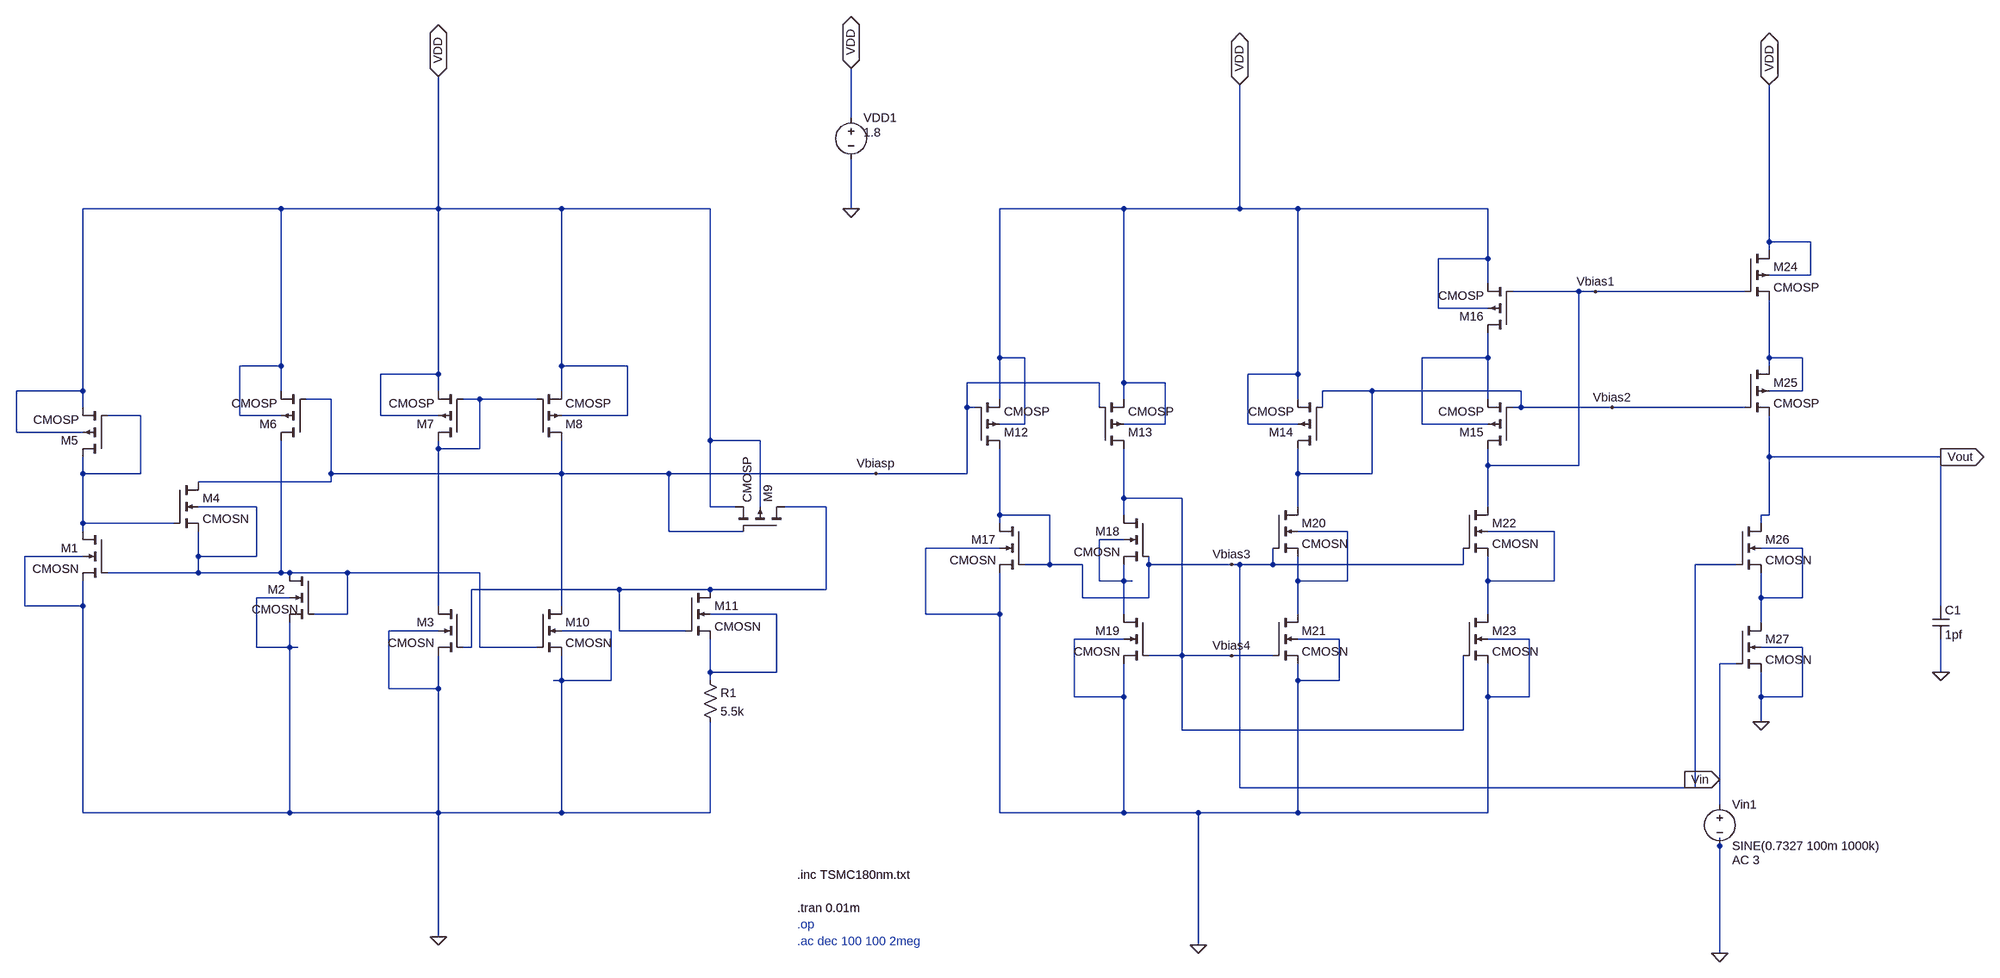
[diagram p0: schematic 180nm.asc]
180nm.asc, the LTspice schematic file:
Version 4
SHEET 1 4800 1076
WIRE 2240 -624 2240 -720
WIRE 1088 -448 704 -448
WIRE 1392 -448 1392 -704
WIRE 1392 -448 1088 -448
WIRE 1680 -448 1392 -448
WIRE 1968 -448 1680 -448
WIRE 2240 -448 2240 -544
WIRE 2768 -448 2528 -448
WIRE 2992 -448 2992 -688
WIRE 2992 -448 2768 -448
WIRE 3104 -448 2992 -448
WIRE 3472 -448 3104 -448
WIRE 4128 -384 4128 -688
WIRE 4208 -384 4128 -384
WIRE 4128 -368 4128 -384
WIRE 3472 -352 3472 -448
WIRE 3472 -352 3376 -352
WIRE 4208 -320 4208 -384
WIRE 4208 -320 4128 -320
WIRE 3472 -304 3472 -352
WIRE 3648 -288 3520 -288
WIRE 3680 -288 3648 -288
WIRE 4080 -288 3680 -288
WIRE 3376 -256 3376 -352
WIRE 3472 -256 3376 -256
WIRE 2528 -160 2528 -448
WIRE 2576 -160 2528 -160
WIRE 3472 -160 3472 -208
WIRE 3472 -160 3344 -160
WIRE 4128 -160 4128 -272
WIRE 4192 -160 4128 -160
WIRE 1088 -144 1088 -448
WIRE 1088 -144 1008 -144
WIRE 1680 -144 1680 -448
WIRE 1808 -144 1680 -144
WIRE 4128 -144 4128 -160
WIRE 1392 -128 1392 -448
WIRE 1392 -128 1280 -128
WIRE 3104 -128 3104 -448
WIRE 3104 -128 3008 -128
WIRE 2720 -112 2464 -112
WIRE 2768 -112 2768 -448
WIRE 2848 -112 2768 -112
WIRE 704 -96 704 -448
WIRE 704 -96 576 -96
WIRE 1088 -96 1088 -144
WIRE 1392 -96 1392 -128
WIRE 1680 -96 1680 -144
WIRE 3248 -96 3152 -96
WIRE 3536 -96 3248 -96
WIRE 4192 -96 4192 -160
WIRE 4192 -96 4128 -96
WIRE 1184 -80 1136 -80
WIRE 1472 -80 1440 -80
WIRE 1632 -80 1472 -80
WIRE 2528 -80 2528 -160
WIRE 2768 -80 2768 -112
WIRE 3104 -80 3104 -128
WIRE 3472 -80 3472 -160
WIRE 704 -64 704 -96
WIRE 2464 -64 2464 -112
WIRE 2480 -64 2464 -64
WIRE 2720 -64 2720 -112
WIRE 3152 -64 3152 -96
WIRE 3536 -64 3536 -96
WIRE 3536 -64 3520 -64
WIRE 3712 -64 3536 -64
WIRE 4080 -64 3712 -64
WIRE 816 -48 752 -48
WIRE 1008 -48 1008 -144
WIRE 1088 -48 1008 -48
WIRE 1280 -48 1280 -128
WIRE 1392 -48 1280 -48
WIRE 1808 -48 1808 -144
WIRE 1808 -48 1680 -48
WIRE 2576 -32 2576 -160
WIRE 2576 -32 2528 -32
WIRE 2848 -32 2848 -112
WIRE 2848 -32 2768 -32
WIRE 3008 -32 3008 -128
WIRE 3104 -32 3008 -32
WIRE 3344 -32 3344 -160
WIRE 3472 -32 3344 -32
WIRE 576 -16 576 -96
WIRE 704 -16 576 -16
WIRE 1968 0 1968 -448
WIRE 2064 0 1968 0
WIRE 1392 16 1392 0
WIRE 1472 16 1472 -80
WIRE 1472 16 1392 16
WIRE 4128 32 4128 -48
WIRE 4688 32 4128 32
WIRE 3472 48 3472 16
WIRE 3648 48 3648 -288
WIRE 3648 48 3472 48
WIRE 704 64 704 32
WIRE 816 64 816 -48
WIRE 816 64 704 64
WIRE 1184 64 1184 -80
WIRE 1680 64 1680 0
WIRE 1680 64 1184 64
WIRE 1888 64 1680 64
WIRE 2288 64 1888 64
WIRE 2464 64 2464 -64
WIRE 2464 64 2288 64
WIRE 3104 64 3104 16
WIRE 3248 64 3248 -96
WIRE 3248 64 3104 64
WIRE 1184 80 1184 64
WIRE 1184 80 928 80
WIRE 2768 112 2768 16
WIRE 2880 112 2768 112
WIRE 1040 128 928 128
WIRE 1968 128 1968 0
WIRE 2016 128 1968 128
WIRE 2064 128 2064 0
WIRE 2192 128 2112 128
WIRE 3104 128 3104 64
WIRE 3472 128 3472 48
WIRE 2528 144 2528 16
WIRE 2624 144 2528 144
WIRE 2768 144 2768 112
WIRE 4128 144 4128 32
WIRE 4128 144 4112 144
WIRE 704 160 704 64
WIRE 880 160 704 160
WIRE 2528 160 2528 144
WIRE 4112 160 4112 144
WIRE 704 176 704 160
WIRE 1888 176 1888 64
WIRE 2032 176 1888 176
WIRE 3200 176 3104 176
WIRE 3600 176 3472 176
WIRE 2768 192 2720 192
WIRE 2528 208 2384 208
WIRE 4192 208 4112 208
WIRE 704 224 592 224
WIRE 928 224 928 176
WIRE 1040 224 1040 128
WIRE 1040 224 928 224
WIRE 2624 240 2624 144
WIRE 2624 240 2576 240
WIRE 2688 240 2624 240
WIRE 2816 240 2816 224
WIRE 2976 240 2816 240
WIRE 2992 240 2976 240
WIRE 3056 240 3056 208
WIRE 3056 240 2992 240
WIRE 3424 240 3424 208
WIRE 3424 240 3056 240
WIRE 4064 240 3984 240
WIRE 928 256 928 224
WIRE 928 256 752 256
WIRE 1088 256 1088 0
WIRE 1088 256 928 256
WIRE 1104 256 1088 256
WIRE 1216 256 1104 256
WIRE 1472 256 1216 256
WIRE 2720 272 2720 192
WIRE 2768 272 2768 240
WIRE 2768 272 2720 272
WIRE 2784 272 2768 272
WIRE 3104 272 3104 224
WIRE 3200 272 3200 176
WIRE 3200 272 3104 272
WIRE 3472 272 3472 224
WIRE 3600 272 3600 176
WIRE 3600 272 3472 272
WIRE 1792 288 1456 288
WIRE 1968 288 1792 288
WIRE 2192 288 2192 128
WIRE 2192 288 1968 288
WIRE 1104 304 1040 304
WIRE 1968 304 1968 288
WIRE 2688 304 2688 240
WIRE 2816 304 2816 240
WIRE 2816 304 2688 304
WIRE 4112 304 4112 256
WIRE 4192 304 4192 208
WIRE 4192 304 4112 304
WIRE 592 320 592 224
WIRE 704 320 704 272
WIRE 704 320 592 320
WIRE 1392 320 1392 16
WIRE 1680 320 1680 64
WIRE 4688 320 4688 32
WIRE 1216 336 1216 256
WIRE 1216 336 1152 336
WIRE 2096 336 1968 336
WIRE 2384 336 2384 208
WIRE 2528 336 2528 256
WIRE 2528 336 2384 336
WIRE 2768 336 2768 272
WIRE 3104 336 3104 272
WIRE 3472 336 3472 272
WIRE 4112 352 4112 304
WIRE 1392 368 1296 368
WIRE 1776 368 1680 368
WIRE 1792 368 1792 288
WIRE 1920 368 1792 368
WIRE 2768 384 2672 384
WIRE 3184 384 3104 384
WIRE 3552 384 3472 384
WIRE 1040 400 1040 304
WIRE 1104 400 1104 352
WIRE 1104 400 1040 400
WIRE 1120 400 1104 400
WIRE 1456 400 1456 288
WIRE 1456 400 1440 400
WIRE 1472 400 1472 256
WIRE 1632 400 1472 400
WIRE 4192 400 4112 400
WIRE 2880 416 2880 112
WIRE 2880 416 2816 416
WIRE 2976 416 2880 416
WIRE 3056 416 2976 416
WIRE 4064 432 4032 432
WIRE 1968 448 1968 384
WIRE 2096 448 2096 336
WIRE 2096 448 1968 448
WIRE 4688 448 4688 384
WIRE 1680 464 1680 416
WIRE 1680 464 1664 464
WIRE 1776 464 1776 368
WIRE 1776 464 1680 464
WIRE 1968 464 1968 448
WIRE 3104 464 3104 432
WIRE 3184 464 3184 384
WIRE 3184 464 3104 464
WIRE 1296 480 1296 368
WIRE 1392 480 1392 416
WIRE 1392 480 1296 480
WIRE 2672 496 2672 384
WIRE 2768 496 2768 432
WIRE 2768 496 2672 496
WIRE 3472 496 3472 432
WIRE 3552 496 3552 384
WIRE 3552 496 3472 496
WIRE 4112 496 4112 448
WIRE 4192 496 4192 400
WIRE 4192 496 4112 496
WIRE 4112 544 4112 496
WIRE 2880 560 2880 416
WIRE 3424 560 3424 416
WIRE 3424 560 2880 560
WIRE 4032 656 4032 432
WIRE 2992 672 2992 240
WIRE 3984 672 3984 240
WIRE 3984 672 2992 672
WIRE 4032 704 4032 656
WIRE 704 720 704 320
WIRE 1104 720 1104 400
WIRE 1104 720 704 720
WIRE 1392 720 1392 480
WIRE 1392 720 1104 720
WIRE 1680 720 1680 464
WIRE 1680 720 1392 720
WIRE 1968 720 1968 544
WIRE 1968 720 1680 720
WIRE 2528 720 2528 336
WIRE 2768 720 2768 496
WIRE 2768 720 2528 720
WIRE 2912 720 2768 720
WIRE 3104 720 3104 464
WIRE 3104 720 2912 720
WIRE 3472 720 3472 496
WIRE 3472 720 3104 720
WIRE 4032 784 4032 768
WIRE 1392 960 1392 720
WIRE 2912 976 2912 720
WIRE 4032 992 4032 784
FLAG 4128 -688 VDD
IOPIN 4128 -688 BiDir
FLAG 4112 544 0
FLAG 4688 448 0
FLAG 4688 32 Vout
IOPIN 4688 32 Out
FLAG 2240 -448 0
FLAG 2240 -720 VDD
IOPIN 2240 -720 BiDir
FLAG 4032 656 Vin
IOPIN 4032 656 In
FLAG 2288 64 Vbiasp
FLAG 3680 -288 Vbias1
FLAG 3712 -64 Vbias2
FLAG 2976 240 Vbias3
FLAG 2976 416 Vbias4
FLAG 4032 992 0
FLAG 1392 -704 VDD
IOPIN 1392 -704 BiDir
FLAG 1392 960 0
FLAG 2992 -688 VDD
IOPIN 2992 -688 BiDir
FLAG 2912 976 0
SYMBOL nmos4 752 176 M0
SYMATTR InstName M1
SYMATTR Value CMOSN
SYMATTR Value2 l=360n w=1800n
SYMBOL nmos4 1152 256 M0
WINDOW 3 121 71 Right 2
SYMATTR Value CMOSN
SYMATTR InstName M2
SYMATTR Value2 l=360n w=1800n
SYMBOL nmos4 1440 320 M0
SYMATTR InstName M3
SYMATTR Value CMOSN
SYMATTR Value2 l=360n w=1800n
SYMBOL nmos4 880 80 R0
SYMATTR InstName M4
SYMATTR Value CMOSN
SYMATTR Value2 l=360nm w=720nm
SYMBOL pmos4 752 32 R180
SYMATTR InstName M5
SYMATTR Value CMOSP
SYMATTR Value2 l=3600nm w=1800nm
SYMBOL pmos4 1136 0 R180
SYMATTR InstName M6
SYMATTR Value CMOSP
SYMATTR Value2 l=360n w=4320n
SYMBOL pmos4 1440 0 R180
SYMATTR InstName M7
SYMATTR Value CMOSP
SYMATTR Value2 l=360n w=4320n
SYMBOL pmos4 1632 0 M180
SYMATTR InstName M8
SYMATTR Value CMOSP
SYMATTR Value2 l=360n w=4320n
SYMBOL pmos4 2112 176 M270
SYMATTR InstName M9
SYMATTR Value CMOSP
SYMATTR Value2 l=360n w=4320n
SYMBOL nmos4 1632 320 R0
SYMATTR InstName M10
SYMATTR Value CMOSN
SYMATTR Value2 l=360n w=1800n
SYMBOL nmos4 1920 288 R0
SYMATTR InstName M11
SYMATTR Value CMOSN
SYMATTR Value2 l=360nm w=5400n
SYMBOL res 1952 448 R0
SYMATTR InstName R1
SYMATTR Value 5.5k
SYMBOL pmos4 2480 16 M180
SYMATTR InstName M12
SYMATTR Value CMOSP
SYMATTR Value2 l=360n w=4320n
SYMBOL pmos4 2720 16 M180
SYMATTR InstName M13
SYMATTR Value CMOSP
SYMATTR Value2 l=360n w=4320n
SYMBOL pmos4 3152 16 R180
SYMATTR InstName M14
SYMATTR Value CMOSP
SYMATTR Value2 l=900nm w=3600nm
SYMBOL pmos4 3520 16 R180
SYMATTR InstName M15
SYMATTR Value CMOSP
SYMATTR Value2 l=360n w=4320n
SYMBOL pmos4 3520 -208 R180
SYMATTR InstName M16
SYMATTR Value CMOSP
SYMATTR Value2 l=360n w=4320n
SYMBOL nmos4 2576 160 M0
SYMATTR InstName M17
SYMATTR Value CMOSN
SYMATTR Value2 l=360nm w=900nm
SYMBOL nmos4 2816 144 M0
SYMATTR InstName M18
SYMATTR Value CMOSN
SYMATTR Value2 l=360n w=1800n
SYMBOL nmos4 2816 336 M0
SYMATTR InstName M19
SYMATTR Value CMOSN
SYMATTR Value2 l=360n w=1800n
SYMBOL nmos4 3056 128 R0
SYMATTR InstName M20
SYMATTR Value CMOSN
SYMATTR Value2 l=360n w=1800n
SYMBOL nmos4 3056 336 R0
SYMATTR InstName M21
SYMATTR Value CMOSN
SYMATTR Value2 l=360n w=1800n
SYMBOL nmos4 3424 128 R0
SYMATTR InstName M22
SYMATTR Value CMOSN
SYMATTR Value2 l=360n w=1800n
SYMBOL nmos4 3424 336 R0
SYMATTR InstName M23
SYMATTR Value CMOSN
SYMATTR Value2 l=360n w=1800n
SYMBOL pmos4 4080 -368 R0
SYMATTR InstName M24
SYMATTR Value CMOSP
SYMATTR Value2 l=180n w=4434n
SYMBOL pmos4 4080 -144 R0
SYMATTR InstName M25
SYMATTR Value CMOSP
SYMATTR Value2 l=180n w=4434n
SYMBOL nmos4 4064 160 R0
SYMATTR InstName M26
SYMATTR Value CMOSN
SYMATTR Value2 l=180n w=900n
SYMBOL nmos4 4064 352 R0
SYMATTR InstName M27
SYMATTR Value CMOSN
SYMATTR Value2 l=180n w=900n
SYMBOL cap 4672 320 R0
SYMATTR InstName C1
SYMATTR Value 1pf
SYMBOL voltage 2240 -640 R0
WINDOW 3 24 44 Left 2
WINDOW 123 0 0 Left 0
WINDOW 39 0 0 Left 0
SYMATTR Value 1.8
SYMATTR InstName VDD1
SYMBOL voltage 4032 688 R0
WINDOW 123 24 124 Left 2
WINDOW 39 0 0 Left 0
SYMATTR Value2 AC 3
SYMATTR InstName Vin1
SYMATTR Value SINE(0.7327 100m 1000k)
TEXT 2136 840 Left 2 !.inc TSMC180nm.txt
TEXT 2136 904 Left 2 !.tran 0.01m
TEXT 2136 936 Left 2 ;.op
TEXT 2136 968 Left 2 ;.ac dec 100 100 2meg

The netlist it stands for:
* 180nm.asc
M1 N004 N005 0 0 CMOSN l=360n w=1800n
M2 N005 N005 0 0 CMOSN l=360n w=1800n
M3 N003 N006 0 0 CMOSN l=360n w=1800n
M4 Vbiasp N004 N005 N005 CMOSN l=360nm w=720nm
M5 N004 N004 VDD VDD CMOSP l=3600nm w=1800nm
M6 N005 Vbiasp VDD VDD CMOSP l=360n w=4320n
M7 N003 N003 VDD VDD CMOSP l=360n w=4320n
M8 Vbiasp N003 VDD VDD CMOSP l=360n w=4320n
M9 N006 Vbiasp VDD VDD CMOSP l=360n w=4320n
M10 Vbiasp N005 0 0 CMOSN l=360n w=1800n
M11 N006 N006 N011 N011 CMOSN l=360nm w=5400n
R1 N011 0 5.5k
M12 Vbias3 Vbiasp VDD VDD CMOSP l=360n w=4320n
M13 Vbias4 Vbiasp VDD VDD CMOSP l=360n w=4320n
M14 Vbias2 Vbias2 VDD VDD CMOSP l=900nm w=3600nm
M15 Vbias1 Vbias2 N001 N001 CMOSP l=360n w=4320n
M16 N001 Vbias1 VDD VDD CMOSP l=360n w=4320n
M17 Vbias3 Vbias3 0 0 CMOSN l=360nm w=900nm
M18 Vbias4 Vbias3 N009 N009 CMOSN l=360n w=1800n
M19 N009 Vbias4 0 0 CMOSN l=360n w=1800n
M20 Vbias2 Vbias3 N007 N007 CMOSN l=360n w=1800n
M21 N007 Vbias4 0 0 CMOSN l=360n w=1800n
M22 Vbias1 Vbias3 N008 N008 CMOSN l=360n w=1800n
M23 N008 Vbias4 0 0 CMOSN l=360n w=1800n
M24 VDD Vbias1 N002 VDD CMOSP l=180n w=4434n
M25 N002 Vbias2 Vout N002 CMOSP l=180n w=4434n
M26 Vout Vbias3 N010 N010 CMOSN l=180n w=900n
M27 N010 Vin 0 0 CMOSN l=180n w=900n
C1 Vout 0 1pf
VDD1 VDD 0 1.8
Vin1 Vin 0 SINE(0.7327 100m 1000k) AC 3
.model NMOS NMOS
.model PMOS PMOS
.lib standard.mos
.inc TSMC180nm.txt
.tran 0.01m
* .op
* .ac dec 100 100 2meg
.backanno
.end